# Altium schematic sheet Power.SchDoc
size Legal; CompanyName: SINEBOTICS; DrawnBy: Tharnath Bagirathan; SheetNumber: 2; SheetTotal: 3
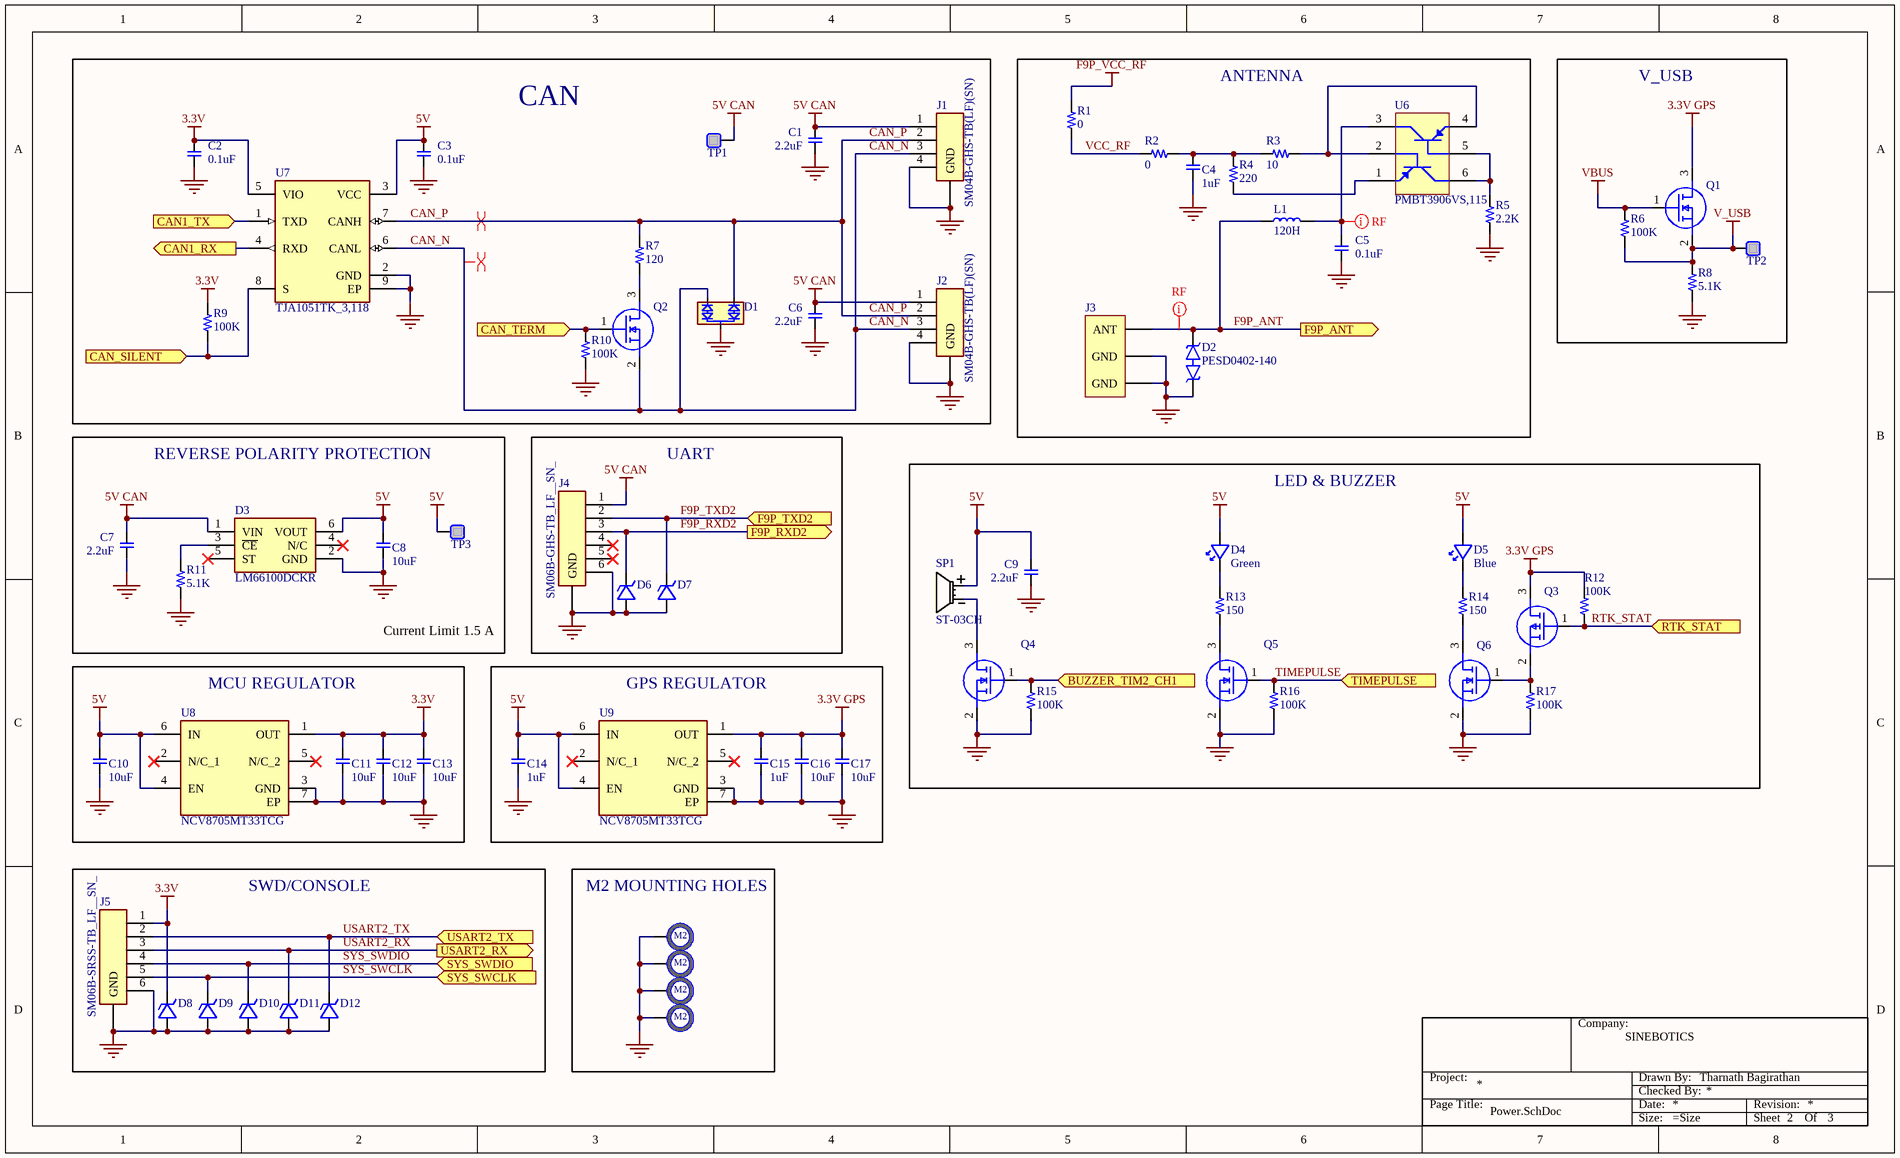
[diagram p0: Power.SchDoc]

## Parts
C1  2.2uF  [C0402]
C2  0.1uF  [C0402]
C3  0.1uF  [C0402]
C4  1uF  [C0402]
C5  0.1uF  [C0402]
C6  2.2uF  [C0402]
C7  2.2uF  [C0402]
C8  10uF  [C0402]
C9  2.2uF  [C0402]
C10  10uF  [C0402]
C11  10uF  [C0402]
C12  10uF  [C0402]
C13  10uF  [C0402]
C14  1uF  [C0402]
C15  1uF  [C0402]
C16  10uF  [C0402]
C17  10uF  [C0402]
D1  PESD1CAN-UX  [PESD1CANUX]  (value not drawn)
D2  PESD0402-140  [DIONC1005X43N]
D3  LM66100DCKR  [SOP65P210X110-6N]
D4  Green  [LTSTS110TBKT]
D5  Blue  [LTSTS110TBKT]
D6  ESD9C3.3ST5G  [SODFL1006X40N]  (value not drawn)
D7  ESD9C3.3ST5G  [SODFL1006X40N]  (value not drawn)
D8  ESD9C3.3ST5G  [SODFL1006X40N]  (value not drawn)
D9  ESD9C3.3ST5G  [SODFL1006X40N]  (value not drawn)
D10  ESD9C3.3ST5G  [SODFL1006X40N]  (value not drawn)
D11  ESD9C3.3ST5G  [SODFL1006X40N]  (value not drawn)
D12  ESD9C3.3ST5G  [SODFL1006X40N]  (value not drawn)
H1  M2  [Hole_M2]  (value not drawn)  (no BOM)
H2  M2  [Hole_M2]  (value not drawn)  (no BOM)
H3  M2  [Hole_M2]  (value not drawn)  (no BOM)
H4  M2  [Hole_M2]  (value not drawn)  (no BOM)
J1  SM04B-GHS-TB(LF)(SN)  [SM04B-GHS-TB]
J2  SM04B-GHS-TB(LF)(SN)  [SM04B-GHS-TB]
J3  0734150963  [MOLEX_0734150963]  (value not drawn)
J4  SM06B-GHS-TB_LF__SN_  [SM06B-GHS-TB]
J5  SM06B-SRSS-TB_LF__SN_  [SM06BSRSSTBLFSN]
L1  120H  [LQW15CNR20J00B]
Q1  DMN53D0L-7  [SOT96P240X110-3N]  (value not drawn)
Q2  DMN53D0L-7  [SOT96P240X110-3N]  (value not drawn)
Q3  BSS223PWH6327XTSA1  [SOT65P210X100-3N]  (value not drawn)
Q4  DMN53D0L-7  [SOT96P240X110-3N]  (value not drawn)
Q5  DMN53D0L-7  [SOT96P240X110-3N]  (value not drawn)
Q6  DMN53D0L-7  [SOT96P240X110-3N]  (value not drawn)
R1  0  [R0402]
R2  0  [R0402]
R3  10  [RESC3225X70N]
R4  220  [R0402]
R5  2.2K  [R0402]
R6  100K  [R0402]
R7  120  [RESC1608X55N]
R8  5.1K  [R0402]
R9  100K  [R0402]
R10  100K  [R0402]
R11  5.1K  [R0402]
R12  100K  [R0402]
R13  150  [R0402]
R14  150  [R0402]
R15  100K  [R0402]
R16  100K  [R0402]
R17  100K  [R0402]
SP1  ST-03CH  [ST03CH]
TitleBlock  TitleBlock  (value not drawn)  (graphical)
TP1  TestPad  [TestPad]  (value not drawn)  (no BOM)
TP2  TestPad  [TestPad]  (value not drawn)  (no BOM)
TP3  TestPad  [TestPad]  (value not drawn)  (no BOM)
U6  PMBT3906VS,115  [PMBT3906VS115]
U7  TJA1051TK_3,118  [SON65P300X300X100-9N-D]
U8  NCV8705MT33TCG  [SON65P200X200X80-7N]
U9  NCV8705MT33TCG  [SON65P200X200X80-7N]

## Blocks framed on the sheet
CAN: C1-C3 C6 D1 J1 J2 Q2 R7 R9 R10 TP1 U7
ANTENNA: C4 C5 D2 J3 L1 R1-R5 U6
V_USB: Q1 R6 R8 TP2
REVERSE POLARITY PROTECTION: C7 C8 D3 R11 TP3
UART: D6 D7 J4
LED & BUZZER: C9 D4 D5 Q3-Q6 R12-R17 SP1
MCU REGULATOR: C10-C13 U8
GPS REGULATOR: C14-C17 U9
SWD/CONSOLE: D8-D12 J5
M2 MOUNTING HOLES: H1-H4

## Ports
BUZZER_TIM2_CH1 (in, see Sensors[1A]), CAN1_RX (out, see Sensors[1A]), CAN1_TX (in, see Sensors[1A]), CAN_SILENT (in, see Sensors[1B]), CAN_TERM (in, see Sensors[1B]), F9P_ANT (out, see Sensors[3A]), F9P_RXD2 (out, see Sensors[3B]), F9P_TXD2 (in, see Sensors[3B]), RTK_STAT (in, see Sensors[4B]), SYS_SWCLK (in, see Sensors[1A]), SYS_SWDIO (in, see Sensors[1A]), TIMEPULSE (in, see Sensors[4B]), USART2_RX (out, see Sensors[1A]), USART2_TX (in, see Sensors[1A])

## Nets
3.3V: C2.2 C11.1 C12.1 C13.1 D8.1(K) J5.1 R9.2 U7.5(VIO) U8.1(OUT)
3.3V GPS: C15.2 C16.1 C17.1 Q1.3(D) Q3.3(D) R12.2 U9.1(OUT)
5V: C3.2 C8.1 C9.2 C10.2 C14.2 D3.6(VOUT) D4.2(A) D5.2(A) SP1.2(+POLARITY) TP3.1 U7.3(VCC) U8.4(EN) U8.6(IN) U9.4(EN) U9.6(IN)
5V CAN: C1.2 C6.2 C7.2 D3.1(VIN) J1.1 J2.1 J4.1 TP1.1
F9P_VCC_RF: R1.2
GND: C1.1 C2.1 C3.1 C4.1 C5.1 C6.1 C7.1 C8.2 C9.1 C10.1 C11.2 C12.2 C13.2 C14.1 C15.1 C16.2 C17.2 D1.3(_COMMON_CATHODE) D2.1 D3.2(GND) D6.2(A) D7.2(A) D8.2(A) D9.2(A) D10.2(A) D11.2(A) D12.2(A) H1.1 H2.1 H3.1 H4.1 J1.0(GND) J1.4 J2.0(GND) J2.4 J3.G1(GND) J3.G2(GND) J4.6 J4.7(GND) J5.6 J5.MP(GND) Q4.2(S) Q5.2(S) Q6.2(S) R5.1 R8.1 R10.1 R11.1 R15.1 R16.1 R17.1 U7.2(GND) U7.9(EP) U8.3(GND) U8.7(EP) U9.3(GND) U9.7(EP)
V_USB: Q1.2(S) R6.1 R8.2 TP2.1
VBUS: Q1.1(G) R6.2
BUZZER_TIM2_CH1: Q4.1(G) R15.2 ; port BUZZER_TIM2_CH1
CAN1_RX: U7.4(RXD) ; port CAN1_RX
CAN1_TX: U7.1(TXD) ; port CAN1_TX
CAN_N: D1.1(CATHODE_1) J1.3 J2.3 Q2.2(S) U7.6(CANL)
CAN_P: D1.2(CATHODE_2) J1.2 J2.2 R7.2 U7.7(CANH)
CAN_SILENT: R9.1 U7.8(S) ; port CAN_SILENT
CAN_TERM: Q2.1(G) R10.2 ; port CAN_TERM
F9P_ANT: D2.2 J3.1(ANT) L1.1 ; port F9P_ANT
F9P_RXD2: D6.1(K) J4.3 ; port F9P_RXD2
F9P_TXD2: D7.1(K) J4.2 ; port F9P_TXD2
RTK_STAT: Q3.1(G) R12.1 ; port RTK_STAT
SYS_SWCLK: D9.1(K) J5.5 ; port SYS_SWCLK
SYS_SWDIO: D10.1(K) J5.4 ; port SYS_SWDIO
TIMEPULSE: Q5.1(G) R16.2 ; port TIMEPULSE
USART2_RX: D11.1(K) J5.3 ; port USART2_RX
USART2_TX: D12.1(K) J5.2 ; port USART2_TX
VCC_RF: R1.1 R2.1
NetC4_2: C4.2 R2.2 R3.1 R4.2
NetC5_2: C5.2 L1.2 U6.3(COLLECTOR_TR2)
NetD3_3: D3.3(~{CE}) R11.2
NetD4_1: D4.1(K) R13.1
NetD5_1: D5.1(K) R14.1
NetQ2_3: Q2.3(D) R7.1
NetQ3_2: Q3.2(S) Q6.1(G) R17.2
NetQ4_3: Q4.3(D) SP1.3(-POLARITY)
NetQ5_3: Q5.3(D) R13.2
NetQ6_3: Q6.3(D) R14.2
NetR3_2: R3.2 U6.2(BASE_TR1) U6.4(EMITTER_TR2)
NetR4_1: R4.1 U6.1(EMITTER_TR1)
NetR5_2: R5.2 U6.5(BASE_TR2) U6.6(COLLECTOR_TR1)

Not connected (* = marked no-connect by the designer): D3 4(N/C)* 5(ST)*; J4 4* 5*; SP1 1(NC_1) 4(NC_2); U8 2(N/C_1)* 5(N/C_2)*; U9 2(N/C_1)* 5(N/C_2)*

## Layout directives
differential pair: CAN_N, CAN_P
net class RF: F9P_ANT, NetC5_2

## Notes on the sheet
- Current Limit 1.5 A
- (in symbol TitleBlock) Company:; Project:; Drawn By:; Checked By:; Page Title:; Date:; Revision:; Size:; Sheet        Of

## Library data of the parts
C1 C6 C7 C9 = CAP_0402: Capacitor 0402 Generic; Manufacturer Part Number: GRM155R61A225ME95D; Manufacturer: Murata; Manufacturer Part Description: CAP CER 2.2uF ±20% 10V X5R 0402 (1005 Metric)
C2 C3 C5 = CAP_0402: Capacitor 0402 Generic; Manufacturer Part Number: 0402X104K250CT; Manufacturer: Walsin Technology Corporation; Manufacturer Part Description: CAP CER 0.1uF ±10% 25V X5R 0402 (1005 Metric)
C4 C14 C15 = CAP_0402: Capacitor 0402 Generic; Manufacturer Part Number: CL05A105KP5NNNC; Manufacturer: Samsung Electro-Mechanics; Manufacturer Part Description: CAP CER 1uF ±10% 10V X5R 0402 (1005 Metric)
C8 C10-C13 C16 C17 = CAP_0402: Capacitor 0402 Generic; Manufacturer Part Number: CL05A106MP8NUB8; Manufacturer: Samsung Electro-Mechanics; Manufacturer Part Description: CAP CER 10uF ±20% 10V X5R 0402 (1005 Metric)
D1 = PESD1CAN-UX: Diode; Manufacturer Name: Nexperia; Datasheet Link: https://assets.nexperia.com/documents/data-sheet/PESD1CAN-U.pdf; Height: 1.1mm; Manufacturer_Part_Number: PESD1CAN-UX; Mouser Price/Stock: https://www.mouser.co.uk/ProductDetail/Nexperia/PESD1CAN-UX?qs=fi7yB2oewZmfG%252BI%252BwWS45Q%3D%3D; Arrow Part Number: PESD1CAN-UX; Arrow Price/Stock: https://www.arrow.com/en/products/pesd1can-ux/nexperia?region=nac; Manufacturer Part Number: PESD1CAN-UX
D2 = PESD0402-140: TVS Diode (Bi-directional); Manufacturer Name: LITTELFUSE; Datasheet Link: https://www.littelfuse.com/~/media/electronics/product_specifications/polymer_esd_suppressors/littelfuse_polymer_esd_suppressor_pesd0402_140_product_specification.pdf.pdf; Height: 0.43mm; Manufacturer_Part_Number: PESD0402-140; Mouser Price/Stock: https://www.mouser.co.uk/ProductDetail/Littelfuse/PESD0402-140?qs=y1EbU1W0OrtTHVfbQV6MTg%3D%3D; Arrow Part Number: PESD0402-140; Arrow Price/Stock: https://www.arrow.com/en/products/pesd0402-140/littelfuse?region=nac; Manufacturer Part Number: PESD0402-140
D3 = LM66100DCKR: Diode; Manufacturer Name: Texas Instruments; Datasheet Link: http://www.ti.com/lit/gpn/LM66100; Height: 1.1mm; Mouser Price/Stock: https://www.mouser.co.uk/ProductDetail/Texas-Instruments/LM66100DCKR?qs=vLWxofP3U2y2yPPrXoBBoA%3D%3D; Arrow Part Number: LM66100DCKR; Arrow Price/Stock: https://www.arrow.com/en/products/lm66100dckr/texas-instruments?region=europe; Manufacturer Part Number: LM66100DCKR
D4 = LTST-S110KGKT: LED; Manufacturer Name: Lite-On; Datasheet Link: https://www.mouser.com/datasheet/2/239/LTST-S110KGKT-1142085.pdf; Height: 1.5mm; Mouser Price/Stock: https://www.mouser.co.uk/ProductDetail/Lite-On/LTST-S110TBKT?qs=NfjNG%252BhMu8ZWYNEUDjruGQ%3D%3D; Arrow Part Number: LTST-S110TBKT; Arrow Price/Stock: https://www.arrow.com/en/products/ltst-s110tbkt/lite-on-technology?region=europe; Manufacturer Part Number: LTST-S110KGKT
D5 = LTST-S110TBKT: LED; Manufacturer Name: Lite-On; Datasheet Link: https://datasheet.datasheetarchive.com/originals/distributors/Datasheets-DGA13/1154201.pdf; Height: 1.5mm; Mouser Price/Stock: https://www.mouser.co.uk/ProductDetail/Lite-On/LTST-S110TBKT?qs=NfjNG%252BhMu8ZWYNEUDjruGQ%3D%3D; Arrow Part Number: LTST-S110TBKT; Arrow Price/Stock: https://www.arrow.com/en/products/ltst-s110tbkt/lite-on-technology?region=europe; Manufacturer Part Number: LTST-S110TBKT
D6-D12 = ESD9C3.3ST5G: TVS Diode (Uni-directional); Manufacturer Name: onsemi; Datasheet Link: https://componentsearchengine.com/Datasheets/1/ESD9C3.3ST5G.pdf; Height: 0.4mm; Mouser Price/Stock: https://www.mouser.co.uk/ProductDetail/onsemi/SZESD9C3.3ST5G?qs=dbuNSGnowt0DiTOhuMf8NQ%3D%3D; Arrow Part Number: SZESD9C3.3ST5G; Arrow Price/Stock: https://www.arrow.com/en/products/szesd9c3.3st5g/on-semiconductor; Manufacturer Part Number: ESD9C3.3ST5G
H1-H4 = Hole_M2
J1 J2 = SM04B-GHS-TB(LF)(SN): Connector; pin to pad: 0>5+6; Manufacturer Name: JST (JAPAN SOLDERLESS TERMINALS); Datasheet Link: http://uk.rs-online.com/web/p/products/7521797; Manufacturer_Part_Number: SM04B-GHS-TB(LF)(SN); Arrow Part Number: SM04B-GHS-TB(LF)(SN); Arrow Price/Stock: https://www.arrow.com/en/products/sm04b-ghs-tb-lf-sn-/jst-manufacturing?region=europe; Manufacturer Part Number: SM04B-GHS-TB(LF)(SN)
J3 = 0734150963: MMCX Connector Jack, Female Socket 50Ohm Board Edge, Cutout; Surface Mount Solder; MF: Molex; Price: None; Purchase-URL: https://pricing.snapeda.com/search/part/0734150963/?ref=eda; Package: None; Check_prices: https://www.snapeda.com/parts/0734150963/Molex/view-part/?ref=eda; Availability: In Stock; MP: 0734150963; Value: *; SnapEDA_Link: https://www.snapeda.com/parts/0734150963/Molex/view-part/?ref=snap
J4 = SM06B-GHS-TB_LF__SN_: Connector; pin to pad: 7>7+8; Manufacturer_Part_Number: SM06B-GHS-TB(LF)(SN); Manufacturer Name: JST (JAPAN SOLDERLESS TERMINALS); Datasheet Link: https://datasheet.datasheetarchive.com/originals/distributors/Datasheets_SAMA/e4ef010dc292ea31091454f6c0afb63a.pdf; Arrow Part Number: SM06B-GHS-TB(LF)(SN); Arrow Price/Stock: https://www.arrow.com/en/products/sm06b-ghs-tb-lf-sn/jst-manufacturing; Manufacturer Part Number: SM06B-GHS-TB(LF)(SN)
J5 = SM06B-SRSS-TB_LF__SN_: Connector; pin to pad: MP>MP1+MP2; Manufacturer Name: JST (JAPAN SOLDERLESS TERMINALS); Manufacturer Part Number: SM06B-SRSS-TB(LF)(SN); Datasheet Link: http://www.jst-mfg.com/product/pdf/eng/eSH.pdf; Height: 2.95mm; Mouser Part Number: SM06B-SRSS-TB(LF)(SN); Arrow Part Number: SM06B-SRSS-TB(LF)(SN); Arrow Price/Stock: https://www.arrow.com/en/products/sm06b-srss-tb-lf-sn/jst-manufacturing?region=europe
L1 = LQW15ANR12J00D: Inductor; Manufacturer Name: Murata Electronics; Datasheet Link: https://datasheet.datasheetarchive.com/originals/distributors/Datasheets_SAMA/97451af591734477ab6d2485aab35b5f.pdf; Height: 0.6mm; Mouser Price/Stock: https://www.mouser.co.uk/ProductDetail/Murata-Electronics/LQW15ANR12J00D/?qs=UV0HhPl4yOHsBH0%2FSRErMg%3D%3D; Arrow Part Number: LQW15ANR12J00D; Arrow Price/Stock: https://www.arrow.com/en/products/lqw15anr12j00d/murata-manufacturing?region=nac; Manufacturer Part Number: LQW15ANR12J00D
Q1 Q2 Q4-Q6 = DMN53D0L-7: MOSFET (N-Channel); Manufacturer Name: Diodes Incorporated; Datasheet Link: http://uk.rs-online.com/web/p/products/9211101P; Height: 1.1mm; Mouser Price/Stock: https://www.mouser.com/Search/Refine.aspx?Keyword=621-DMN53D0L-7; Arrow Part Number: DMN53D0L-7; Arrow Price/Stock: https://www.arrow.com/en/products/dmn53d0l-7/diodes-incorporated; Manufacturer Part Number: DMN53D0L-7
Q3 = BSS223PWH6327XTSA1: MOSFET (P-Channel); Manufacturer Name: Infineon; Datasheet Link: https://componentsearchengine.com/Datasheets/2/BSS223PWH6327XTSA1.pdf; Height: 1mm; Mouser Price/Stock: https://www.mouser.co.uk/ProductDetail/Infineon-Technologies/BSS223PWH6327XTSA1?qs=Dj8dEyEphkMhtpM4HseAjA%3D%3D; Arrow Part Number: BSS223PWH6327XTSA1; Arrow Price/Stock: https://www.arrow.com/en/products/bss223pwh6327xtsa1/infineon-technologies-ag; Manufacturer Part Number: BSS223PWH6327XTSA1
R1 R2 = RES_0402: Resistor 0402 Generic; Manufacturer: Yageo; Manufacturer Part Number: AC0402JR-070RL; Manufacturer Part Description: RES 0 Ohm Jumper 1/16W 0402 (1005 Metric)
R3 = RES_10_1/2W: Resistor; Manufacturer_Part_Number: RMCF1210JT10R0; Manufacturer Name: Stackpole Electronics; Datasheet Link: https://cs.seielect.com/catalog/SEI-RMCF_RMCP.pdf; Height: 0.7mm; Mouser Price/Stock: https://www.mouser.co.uk/ProductDetail/SEI-Stackpole/RMCF1210JT10R0?qs=FESYatJ8odJ2YkqCzkIQWw%3D%3D; Arrow Part Number: RMCF1210JT10R0; Arrow Price/Stock: https://www.arrow.com/en/products/rmcf1210jt10r0/stackpole-electronics?region=nac; Manufacturer Part Number: RMCF1210JT10R0
R4 = RES_0402: Resistor 0402 Generic; Manufacturer: Stackpole Electronics Inc; Manufacturer Part Number: RMCF0402JT220R; Manufacturer Part Description: RES 220 Ohm ±5% 1/16W 0402 (1005 Metric)
R5 = RES_0402: Resistor 0402 Generic; Manufacturer: Yageo; Manufacturer Part Number: AC0402FR-072K2L; Manufacturer Part Description: RES 2.2K Ohm ±1% 1/16W 0402 (1005 Metric)
R6 R9 R10 R12 R15-R17 = RES_0402: Resistor 0402 Generic; Manufacturer: Yageo; Manufacturer Part Number: AC0402JR-07100KL; Manufacturer Part Description: RES 100K Ohm ±5% 1/16W 0402 (1005 Metric)
R7 = RES_120: Resistor; Manufacturer_Part_Number: RMCF0603FT120R; Manufacturer Name: Stackpole Electronics; Datasheet Link: https://www.seielect.com/Catalog/SEI-RMCF_RMCP.pdf; Height: 0.55mm; Arrow Part Number: RMCF0603FT120R; Arrow Price/Stock: https://www.arrow.com/en/products/rmcf0603ft120r/stackpole-electronics; Manufacturer Part Number: RMCF0603FT120R
R8 R11 = RES_0402: Resistor 0402 Generic; Manufacturer: Yageo; Manufacturer Part Number: RC0402FR-075K1L; Manufacturer Part Description: RES 5.1K Ohm ±1% 1/16W 0402 (1005 Metric)
R13 R14 = RES_0402: Resistor 0402 Generic; Manufacturer: Stackpole Electronics Inc; Manufacturer Part Number: RC0402FR-07150RL; Manufacturer Part Description: RES 150 Ohm ±1% 1/16W 0402 (1005 Metric)
SP1 = ST-03CH: Loudspeaker or Buzzer; Manufacturer_Name: Soberton Inc.; Datasheet Link: https://www.soberton.com/wp-content/uploads/2019/02/ST-03CH-19-Feb-2019.pdf; Height: 3.5mm; Mouser Part Number: ST-03CH; Manufacturer Part Number: ST-03CH
TitleBlock = TitleBlock: TitleBlock For Schematics
TP1-TP3 = TestPad: Test Pads
U6 = PMBT3906VS,115: Transistor BJT PNP; Manufacturer Name: Nexperia; Datasheet Link: https://assets.nexperia.com/documents/data-sheet/PMBT3906VS.pdf; Height: 0.6mm; Mouser Part Number: PMBT3906VS,115; Mouser Price/Stock: https://www.mouser.co.uk/ProductDetail/Nexperia/PMBT3906VS115?qs=LMSg3oBIm%2FguPDYx3FiBDA%3D%3D; Arrow Part Number: PMBT3906VS,115; Arrow Price/Stock: https://www.arrow.com/en/products/pmbt3906vs115/nexperia?region=nac; Manufacturer Part Number: PMBT3906VS,115
U7 = TJA1051TK_3,118: Integrated Circuit; Manufacturer_Name: NXP; Manufacturer_Part_Number: TJA1051TK/3,118; Datasheet Link: http://www.nxp.com/docs/en/data-sheet/TJA1051.pdf; Height: 1mm; Mouser Price/Stock: https://www.mouser.co.uk/ProductDetail/NXP-Semiconductors/TJA1051TK-3118?qs=fhAOlxDPaYVrDQ2e4g%252BBJA%3D%3D; Arrow Part Number: TJA1051TK/3,118; Arrow Price/Stock: https://www.arrow.com/en/products/tja1051tk3118/nxp-semiconductors?region=nac; Manufacturer Part Number: TJA1051TK/3,118
U8 U9 = NCV8705MT33TCG: Integrated Circuit; Manufacturer Name: onsemi; Datasheet Link: https://mouser.componentsearchengine.com/Datasheets/2/NCV8705MT33TCG.pdf; Height: 0.8mm; Mouser Part Number: NCV8705MT33TCG; Mouser Price/Stock: https://www.mouser.co.uk/ProductDetail/onsemi/NCV8705MT33TCG?qs=dbuNSGnowt08ckPc9kUZHw%3D%3D; Arrow Part Number: NCV8705MT33TCG; Arrow Price/Stock: https://www.arrow.com/en/products/ncv8705mt33tcg/on-semiconductor; Manufacturer Part Number: NCV8705MT33TCG